# EAGLE design RscDroneBadgeMini (EAGLE 9.6.2)
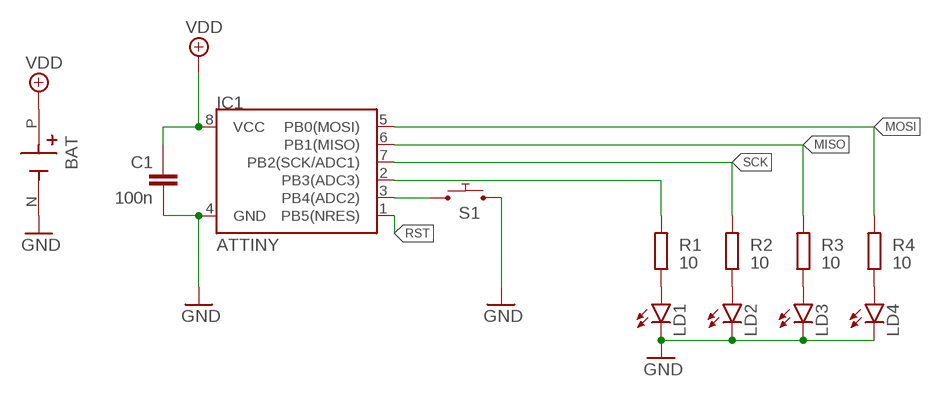
[diagram p0: schematic, sheet 1]

## Parts
BAT  CR2032  CR2032_PLASTIC  [CR2032_PLASTIC]
C1  100n  CAPACITOR_THT_2.54  [C_2.54]
IC1  ATTINY  ATTINY85-20PU  [DIL08]
LD1  LED_THT-5MM_NICE  [LED_5MM_NICE]
LD2  LED_THT-5MM_NICE  [LED_5MM_NICE]
LD3  LED_THT-5MM_NICE  [LED_5MM_NICE]
LD4  LED_THT-5MM_NICE  [LED_5MM_NICE]
R1  10  RESISTOR_0207_THT0204/7_ROUND  [RCL_0207]
R2  10  RESISTOR_0207_THT0204/7_ROUND  [RCL_0207]
R3  10  RESISTOR_0207_THT0204/7_ROUND  [RCL_0207]
R4  10  RESISTOR_0207_THT0204/7_ROUND  [RCL_0207]
S1  6x6mm BUTTON  PUSH_MOMENTARY_THT_6X6MM  [TACTILE-PTH]

## Nets
GND: BAT.N(NEG) C1.2 IC1.4(GND) LD1.K(C) LD2.K(C) LD3.K(C) LD4.K(C) S1.3 S1.4
MISO: IC1.6(PB1(MISO)) R3.2
MOSI: IC1.5(PB0(MOSI)) R4.2
N$1: IC1.3(PB4(ADC2)) S1.1 S1.2
N$3: LD1.A R1.1
N$5: LD2.A R2.1
N$6: LD3.A R3.1
N$7: LD4.A R4.1
N$9: IC1.2(PB3(ADC3)) R1.2
RST: IC1.1(PB5(NRES))
SCK: IC1.7(PB2(SCK/ADC1)) R2.2
VDD: BAT.P(POS) C1.1 IC1.8(VCC)

## Library data of the parts
BAT = BASTL_BATHOLDER:CR2032_PLASTIC: DS1092-04-B6P BH-25F-1
C1 = BASTL_CAPACITORS:CAPACITOR_THT: CAPACITOR, European symbol
IC1 = BASTL_ICS:ATTINY85: Atmel 8-pin 2/4/8kB flash uC; TYPE: THT
LD1-LD4 = BASTL_LEDS:LED_THT: [color]_[diameter]_[difused/clear] R_3mm_D
R1-R4 = BASTL_RESISTORS:RESISTOR_0207_THT: RESISTOR, European symbol
S1 = BASTL_SWITCHES:PUSH_MOMENTARY: Various NO switches- pushbuttons, reed, etc THT: TL1105SPF100Q SMT: TL3301SPF100QG, TL3301SPF160QG...; TYPE: THT

## Board
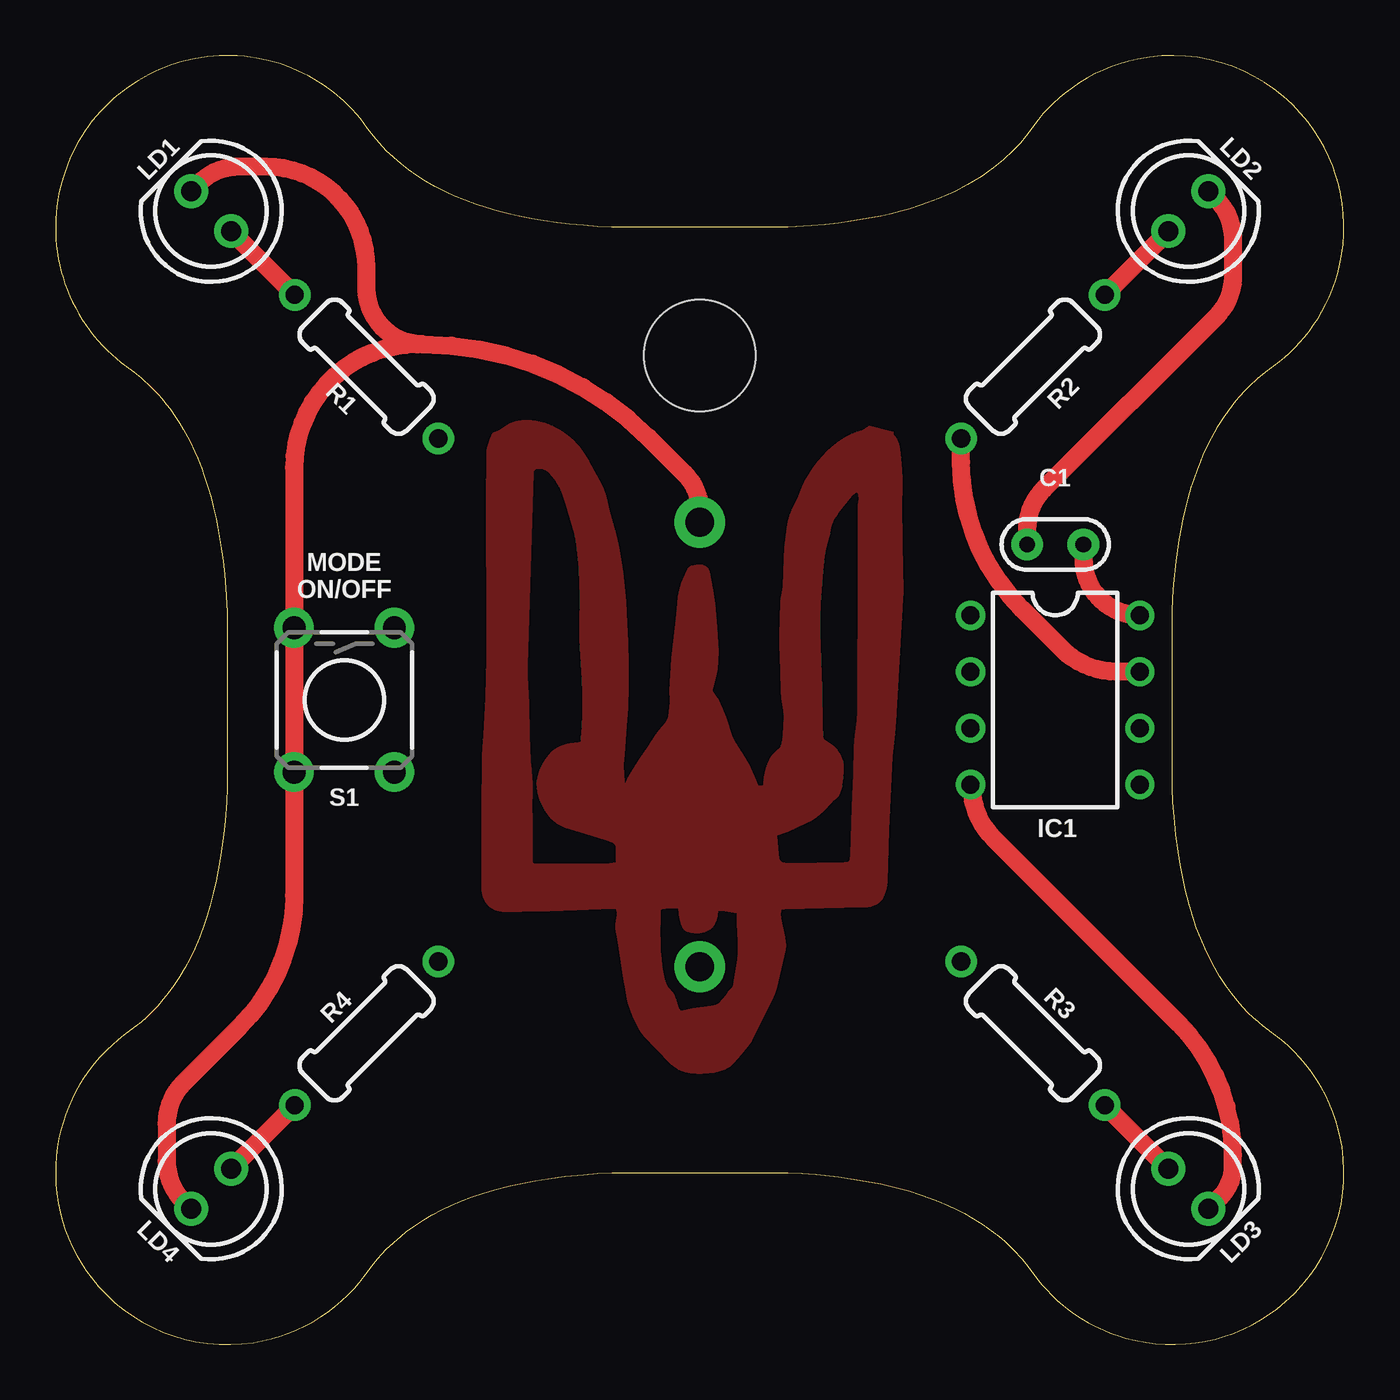
[diagram p1: board, top side]
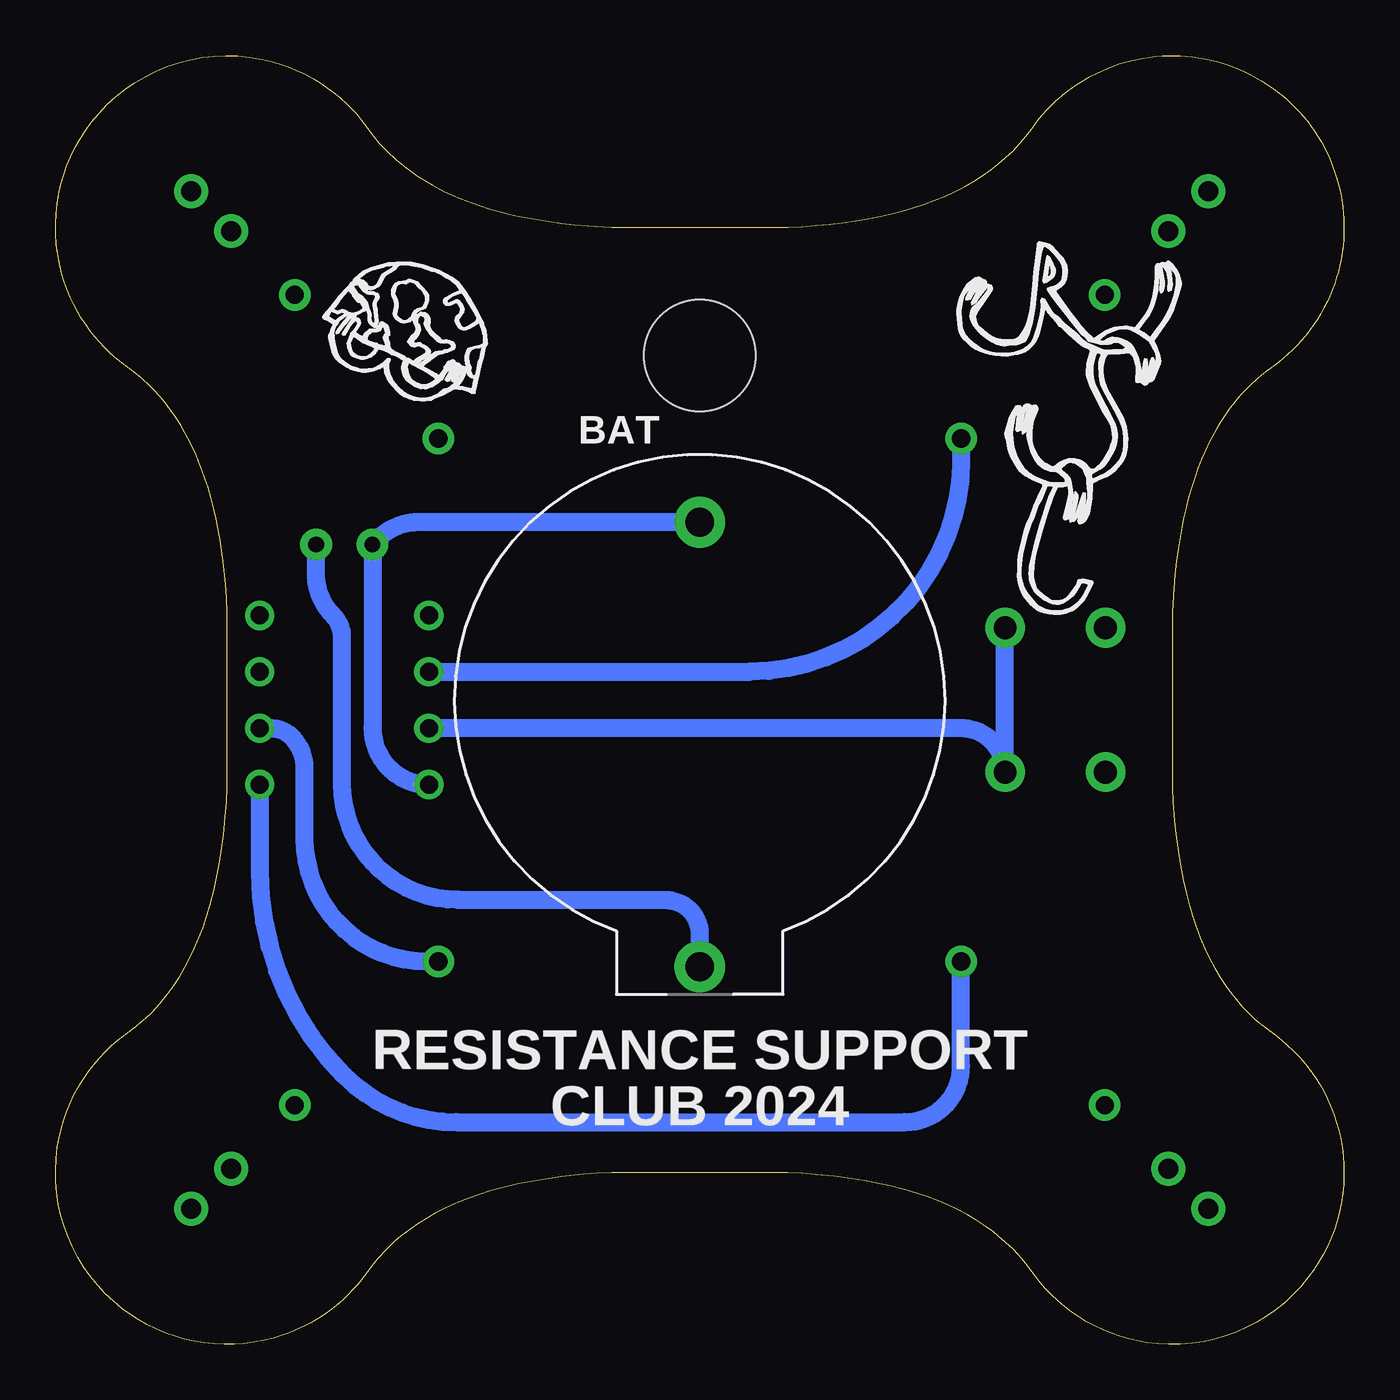
[diagram p2: board, bottom side, seen from below]

Size 58 x 58 mm. Coordinates in mm from the lower left corner, seen from the top.
Outline: 14.06,54.71 13.73,55.15 13.55,55.36 13.35,55.59 12.96,55.97 12.54,56.32 12.11,56.65 11.65,56.94 11.41,57.07 11.13,57.21 10.64,57.44 10.12,57.62 9.6,57.77 9.07,57.88 8.76,57.93 8.49,57.96 8.18,57.99 7.91,58 7.37,57.99 6.82,57.95 6.28,57.86 5.75,57.74 5.23,57.58 4.72,57.39 4.47,57.28 4.2,57.14 3.72,56.88 3.26,56.58 2.83,56.25 2.62,56.07 2.4,55.86 2.01,55.47 1.66,55.06 1.34,54.62 1.17,54.36 1.03,54.13 0.78,53.64 0.65,53.36 0.54,53.11 0.36,52.6 0.21,52.07 0.15,51.77 0.1,51.5 0.06,51.2 0.03,50.93 0.01,50.62 0,50.35 0,50.04 0.02,49.74 0.04,49.47 0.08,49.16 0.13,48.86 0.19,48.56 0.26,48.26 0.34,48 0.42,47.74 0.53,47.45 0.65,47.17 0.76,46.92 0.9,46.64 1.05,46.38 1.21,46.11 1.38,45.86 1.54,45.64 1.73,45.4 1.92,45.16 2.11,44.96 2.32,44.74 2.52,44.55 2.94,44.2 3.51,43.77 3.86,43.5 4.28,43.1 4.59,42.78 4.79,42.55 4.99,42.31 5.15,42.1 5.41,41.73 5.59,41.45 5.75,41.18 6.05,40.61 6.26,40.18 6.4,39.87 6.57,39.42 6.7,39.07 6.86,38.58 7,38.09 7.1,37.7 7.22,37.16 7.3,36.76 7.4,36.23 7.46,35.82 7.54,35.25 7.61,34.64 7.66,34.03 7.73,32.97 7.73,25.06 7.7,24.41 7.63,23.56 7.56,22.95 7.46,22.17 7.37,21.6 7.23,20.87 7.1,20.3 6.96,19.77 6.8,19.25 6.64,18.77 6.46,18.29 6.26,17.82 6.05,17.39 5.81,16.93 5.59,16.55 5.33,16.15 5.07,15.79 4.86,15.53 4.59,15.22 4.38,14.99 4.09,14.71 3.86,14.5 3.62,14.31 3.07,13.9 2.8,13.69 2.55,13.47 2.27,13.21 1.99,12.91 1.75,12.63 1.52,12.33 1.3,12.03 1.1,11.71 0.91,11.38 0.75,11.05 0.59,10.71 0.46,10.36 0.34,10 0.24,9.64 0.16,9.27 0.08,8.87 0.03,8.46 0.01,8.06 0,7.61 0.02,7.2 0.06,6.8 0.12,6.36 0.2,5.96 0.31,5.56 0.45,5.14 0.59,4.76 0.76,4.39 0.95,4.02 1.15,3.67 1.38,3.33 1.62,3 1.95,2.6 2.3,2.23 2.67,1.88 3.07,1.56 3.49,1.27 3.93,1 4.38,0.76 4.85,0.56 5.33,0.38 5.82,0.24 6.32,0.13 6.82,0.05 7.37,0.01 7.88,0 8.39,0.03 8.9,0.09 9.3,0.16 9.7,0.25 10.09,0.37 10.48,0.5 10.86,0.66 11.23,0.83 11.59,1.03 11.93,1.24 12.24,1.45 12.57,1.7 12.88,1.96 13.18,2.24 13.44,2.51 13.69,2.8 13.9,3.06 14.33,3.64 14.5,3.85 14.7,4.08 14.89,4.28 15.21,4.58 15.55,4.87 15.79,5.06 16.15,5.32 16.55,5.59 16.96,5.83 17.38,6.05 17.81,6.26 18.28,6.46 18.76,6.64 19.24,6.8 19.77,6.96 20.46,7.14 21.03,7.26 21.6,7.37 22.17,7.46 22.95,7.56 23.76,7.65 24.41,7.7 25.05,7.73 32.97,7.73 33.61,7.69 34.22,7.65 35.24,7.54 36.22,7.4 37.16,7.22 37.52,7.14 38.05,7.01 38.42,6.91 38.94,6.74 39.39,6.58 39.74,6.45 40.18,6.26 40.61,6.06 40.91,5.9 41.21,5.73 41.73,5.41 42.23,5.05 42.47,4.86 42.73,4.64 43.12,4.26 43.49,3.86 43.77,3.52 44.22,2.92 44.41,2.68 44.62,2.45 44.83,2.23 45.08,2 45.34,1.77 45.58,1.58 45.85,1.38 46.17,1.17 46.49,0.98 46.82,0.81 47.16,0.65 47.51,0.51 47.86,0.38 48.19,0.28 48.62,0.18 49.09,0.09 49.53,0.04 49.97,0.01 50.41,0 50.89,0.02 51.33,0.07 51.77,0.14 52.2,0.24 52.63,0.37 53.04,0.51 53.48,0.7 53.88,0.89 54.27,1.11 54.64,1.35 55,1.61 55.39,1.94 55.76,2.29 56.11,2.67 56.43,3.06 56.73,3.48 57,3.92 57.23,4.37 57.44,4.84 57.61,5.32 57.76,5.81 57.87,6.31 57.95,6.81 57.99,7.32 58,7.84 57.98,8.35 57.92,8.89 57.84,9.29 57.75,9.69 57.64,10.08 57.5,10.47 57.35,10.85 57.17,11.22 56.98,11.58 56.76,11.93 56.53,12.26 56.28,12.59 56.02,12.9 55.76,13.17 55.49,13.43 55.21,13.68 54.94,13.89 54.37,14.32 54.16,14.49 53.93,14.7 53.7,14.91 53.42,15.2 53.22,15.43 52.94,15.78 52.68,16.14 52.42,16.54 52.18,16.95 51.95,17.37 51.75,17.8 51.55,18.27 51.37,18.75 51.19,19.27 51.04,19.79 50.87,20.45 50.74,21.02 50.63,21.59 50.54,22.16 50.44,22.94 50.35,23.75 50.3,24.4 50.27,25.04 50.27,32.96 50.3,33.6 50.35,34.21 50.46,35.23 50.6,36.21 50.78,37.15 50.87,37.55 51,38.08 51.14,38.57 51.25,38.93 51.41,39.38 51.55,39.73 51.68,40.04 51.89,40.51 52.18,41.05 52.35,41.35 52.59,41.72 52.94,42.22 53.13,42.46 53.33,42.69 53.51,42.9 53.73,43.12 54.13,43.48 54.48,43.76 55.1,44.23 55.34,44.43 55.57,44.63 55.81,44.87 56.02,45.1 56.22,45.33 56.43,45.6 56.65,45.9 56.84,46.19 57.01,46.48 57.19,46.81 57.33,47.12 57.48,47.47 57.6,47.82 57.71,48.18 57.82,48.61 57.91,49.08 57.96,49.52 57.99,49.96 58,50.4 57.98,50.88 57.93,51.32 57.86,51.76 57.76,52.19 57.64,52.62 57.49,53.03 57.32,53.44 57.11,53.87 56.89,54.26 56.65,54.63 56.39,54.99 56.04,55.41 55.67,55.8 55.29,56.15 54.86,56.49 54.44,56.78 53.97,57.06 53.48,57.3 52.98,57.51 52.46,57.68 51.93,57.82 51.4,57.92 50.85,57.98 50.34,58 49.8,57.99 49.25,57.93 48.72,57.84 48.32,57.75 47.92,57.64 47.54,57.5 47.16,57.35 46.79,57.17 46.43,56.98 46.08,56.77 45.74,56.54 45.44,56.31 45.18,56.09 44.9,55.84 44.66,55.6 44.46,55.37 44.24,55.11 43.69,54.37 43.42,54.06 43.1,53.71 42.68,53.31 42.23,52.95 41.98,52.76 41.7,52.57 41.32,52.33 41.06,52.18 40.48,51.88 40.17,51.74 39.74,51.55 39.26,51.37 38.93,51.26 38.41,51.09 38.05,50.99 37.56,50.87 37.16,50.78 36.62,50.67 36.22,50.6 35.82,50.54 35.24,50.46 34.63,50.39 34.02,50.33 32.96,50.27 25.02,50.27 24.41,50.3 23.76,50.35 23.15,50.41 22.57,50.48 21.97,50.57 21.43,50.66 20.86,50.77 20.46,50.86 19.93,51 19.41,51.15 18.92,51.31 18.44,51.48 17.97,51.67 17.53,51.87 17.08,52.11 16.66,52.34 16.29,52.58 15.9,52.85 15.55,53.13 15.21,53.42 14.89,53.72 14.59,54.05 14.33,54.36 14.06,54.71
Copper layers (1*16): Top 0.035mm / dielectric 1.5mm / Bottom 0.035mm
Design rules "default_tenting_vias": minimum track width 6mil, minimum drill 0.35mm, track to track 6mil, track to pad 6mil, pad to pad 6mil, via to via 6mil, smd to smd 6mil, copper to edge 20mil, drill to drill 6mil, minimum pad ring 10mil, minimum via ring 8mil, stop-mask expansion 4mil, vias tented up to drill 15mil, thermal gap 10mil
Holes 5 mm at 29,44.5

### Footprints (pad centres in the part's own frame; a part is rotated, then mirrored left to right if it is on the bottom)
CR2032_PLASTIC = drill 1.3 pad 2.286: N -8,0; P 12,0
C_2.54 = drill 0.7 pad 1.422: 1 -1.27,0; 2 1.27,0
DIL08 = drill 0.813 pad 1.27: 1 -3.81,-3.81; 2 -1.27,-3.81; 3 1.27,-3.81; 4 3.81,-3.81; 5 3.81,3.81; 6 1.27,3.81; 7 -1.27,3.81; 8 -3.81,3.81
LED_5MM_NICE = drill 0.9 pad 1.524: A -1.27,0; K 1.27,0
RCL_0207 = drill 0.813 pad 1.422: 1 -4.572,0; 2 4.572,0
TACTILE-PTH = drill 1.016 pad 1.778: 1 -3.251,2.261; 2 3.251,2.261; 3 -3.251,-2.261; 4 3.251,-2.261

### Placement (x,y rotation side)
BAT  29,29 270 bottom
C1  45,36 180 top
IC1  45,29 270 top
LD1  7,51 135 top
LD2  51,51 45 top
LD3  51,7 315 top
LD4  7,7 225 top
R1  14,44 315 top
R2  44,44 225 top
R3  44,14 135 top
R4  14,14 45 top
S1  13,29 270 top

### Tracks (layer width: path | path; a pad name or v marks a point on that pad's centre or on a via)
GND
  Top 0.8: LD3.K 52.44,6.64 arc45 53,8 53,8.53 arc45 50.55,14.45 42.23,22.77 arc-45 41.25,25.13 IC1.4 | LD2.K 52.26,51.54 arc-45 53,49.74 53,48.05 arc-45 52.26,46.26 44.47,38.47 arc45 43.73,36.68 C1.2 | LD1.K 6.46,52.26 arc-45 8.26,53 9.46,53 arc-90 14,48.46 14,47.54 arc90 16.54,45 | LD4.K 5.74,6.46 arc-45 5,8.26 5,9.95 arc-45 5.74,11.74 8.29,14.29 arc45 10.74,20.21 S1.4 S1.3 10.74,39.46 arc-90 16.28,45 16.54,45 | BAT.N 29,37.53 arc45 28.32,39.18 26.7,40.8 arc45 16.57,45 16.54,45
  Bottom 0.8: IC1.4 arc90 43.73,27.73 C1.2 43.47,36.26 arc45 41.68,37 BAT.N
  pour Top (rank 3): 38.13,36.05 38.11,37.79 38.13,38.59 38.13,38.9 38.1,39.36 38.05,39.85 38,40.29 37.96,40.5 37.92,40.61 37.87,40.73 37.81,40.82 37.72,40.92 37.71,41.05 37.7,41.05 36.64,41.32 36.32,41.11 36.08,41.05 35.85,40.96 35.63,40.85 35.4,40.71 35.17,40.55 34.95,40.37 34.73,40.17 34.52,39.95 34.32,39.71 34.11,39.43 33.91,39.14 33.72,38.82 33.6,38.58 33.39,38.06 33.19,37.67 33.06,37.34 32.98,37.03 32.93,36.77 32.82,35.88 32.79,35.39 32.74,34.1 32.65,33.45 32.61,32.61 32.59,31.99 32.59,31.44 32.61,30.95 32.64,30.3 32.65,29.42 32.68,29.07 32.76,28.54 32.78,28.23 32.78,27.86 32.74,27.4 32.7,27.08 32.64,26.88 32.6,26.83 32.43,26.68 32.27,26.51 32.14,26.32 32.04,26.11 31.98,25.93 31.93,25.73 31.9,25.53 31.88,25.25 31.86,25.15 31.85,25.14 31.8,25.13 31.64,25.12 31.47,25.54 31.28,25.94 31.03,26.39 30.61,27.06 30.45,27.39 30.18,28.21 30.03,28.61 29.86,28.96 29.74,29.15 29.61,29.34 29.58,29.4 29.58,29.47 29.59,29.54 29.71,29.98 29.79,30.38 29.83,30.77 29.84,31.17 29.78,32.27 29.69,33.34 29.6,33.95 29.44,34.76 29.39,34.88 29.33,34.96 29.25,35.02 29.13,35.06 29.03,35.07 28.85,35.06 28.74,35.05 28.61,35.01 28.51,34.94 28.45,34.88 28.4,34.8 28.18,34.27 28.08,33.96 28.02,33.65 27.99,33.35 27.94,32.63 27.73,30.88 27.65,29.77 27.65,29.47 27.66,28.93 27.65,28.7 27.63,28.47 27.58,28.26 27.52,28.1 27.44,27.94 27.35,27.83 27.17,27.62 27.03,27.43 26.68,26.88 26.32,26.36 25.99,25.86 25.72,25.4 25.67,25.27 25.64,25.13 25.6,25.62 25.58,26.08 25.62,26.54 25.7,27.84 25.78,28.63 25.8,29.65 25.79,30.62 25.77,31.61 25.73,32.45 25.67,33.42 25.61,34.13 25.55,34.76 25.47,35.33 25.38,35.85 25.31,36.16 25.24,36.46 24.94,37.49 24.77,38.19 24.67,38.5 24.56,38.75 24.36,39.1 24,39.77 22.58,38.78 22.68,38.59 22.83,38.25 22.97,37.85 23.36,36.48 23.44,36.13 23.49,35.78 23.53,35.35 23.56,34.92 23.59,34.24 23.6,33.67 23.59,32.4 23.6,31.71 23.71,29.92 23.73,29.34 23.73,28.91 23.72,28.38 23.7,27.79 23.66,27.28 23.65,27.17 23.63,27.1 23.6,27.08 23.54,27.07 23.17,27.03 23.03,27 22.89,26.97 22.76,26.92 22.62,26.85 22.47,26.75 22.33,26.64 22.2,26.5 22.05,26.3 21.92,26.09 21.82,25.89 21.74,25.67 21.69,25.47 21.66,25.26 21.67,25.06 21.69,24.85 21.74,24.67 21.81,24.47 21.92,24.24 22.04,24.03 22.16,23.86 22.29,23.71 22.43,23.58 22.58,23.46 22.75,23.36 22.95,23.28 23.84,23.01 24.78,22.71 25.03,22.62 25.09,22.59 25.15,22.55 25.19,22.51 25.21,22.46 25.23,22.39 25.24,22.31 25.24,21.83 25.23,21.71 25.22,21.67 25.21,21.66 25.11,21.64 24.93,21.64 21.77,21.62 21.53,21.64 21.5,21.65 21.48,21.68 21.47,21.75 21.47,23.68 21.44,24.17 21.47,24.89 21.47,25.25 21.45,25.51 21.43,25.83 21.43,25.85 21.39,26.24 21.36,26.85 21.35,27.4 21.32,28.86 21.26,30.08 21.24,30.54 21.51,39.25 21.54,39.33 21.58,39.39 21.66,39.42 21.75,39.43 21.87,39.42 21.99,39.39 22.1,39.34 22.21,39.25 22.33,39.12 22.46,38.95 22.58,38.78 24,39.77 23.8,40.09 23.59,40.37 23.46,40.51 23.33,40.65 23.18,40.79 23.03,40.91 22.89,41.01 22.73,41.12 22.56,41.21 22.39,41.3 22.19,41.38 22.01,41.44 21.8,41.5 21.61,41.53 21.42,41.56 21.21,41.57 20.98,41.56 20.82,41.55 20.7,41.52 20.58,41.48 20.47,41.44 20.34,41.37 19.96,41.13 19.71,40.99 19.63,40.92 19.58,40.83 19.43,40.32 19.41,40.17 19.39,40.02 19.39,37.89 19.4,32.07 19.39,30.84 19.38,30.02 19.35,29.11 19.26,27.42 19.21,26.82 19.2,26.5 19.18,23.89 19.18,20.45 19.19,20.33 19.22,20.21 19.27,20.08 19.35,19.94 19.44,19.81 19.56,19.7 19.67,19.62 19.79,19.57 19.97,19.52 20.11,19.49 20.25,19.49 20.97,19.49 22.24,19.52 23.46,19.56 25.1,19.63 25.19,19.62 25.23,19.6 25.25,19.57 25.26,19.54 25.27,19.42 25.27,19.31 25.2,18.93 25.2,18.8 25.21,18.7 25.32,18.09 25.57,16.45 27.35,16.76 27.3,17.04 27.27,17.36 27.24,17.71 27.23,18.1 27.22,18.57 27.23,19.1 27.24,19.51 27.25,19.56 27.26,19.59 27.31,19.61 27.47,19.63 28.05,19.64 28.07,19.35 28.1,19.12 28.16,18.93 28.23,18.77 28.27,18.72 28.32,18.67 28.43,18.6 28.58,18.55 28.75,18.53 28.98,18.54 29.21,18.58 29.31,18.61 29.4,18.65 29.48,18.7 29.53,18.74 29.6,18.81 29.65,18.88 29.69,18.95 29.73,19.05 29.8,19.27 29.83,19.53 30.15,19.51 30.55,19.44 30.67,19.43 30.67,18.95 30.72,18.11 30.73,17.83 30.72,17.56 30.7,17.35 30.69,17.34 30.55,16.4 30.51,16.19 30.48,16.09 30.42,16 30.3,15.87 30.18,15.68 29.86,15.32 29.82,15.3 29.73,15.27 29.53,15.22 28.67,15.1 28.48,15.06 28.28,15.01 28.19,14.99 28.12,14.99 28.09,15.05 28.05,15.15 27.93,15.52 27.87,15.69 27.78,15.82 27.6,16.03 27.51,16.19 27.42,16.44 27.35,16.76 25.57,16.45 25.67,15.84 25.74,15.53 25.8,15.29 25.88,15.04 25.97,14.79 26.08,14.53 26.22,14.29 26.36,14.07 26.52,13.88 27.02,13.33 27.69,12.66 27.81,12.55 27.93,12.47 28.05,12.39 28.16,12.34 28.36,12.27 28.58,12.23 28.85,12.2 29.13,12.2 29.41,12.21 29.65,12.25 29.89,12.31 30.11,12.39 30.24,12.45 30.36,12.52 30.44,12.59 30.54,12.69 30.86,13.06 31.23,13.53 31.34,13.69 31.41,13.82 31.9,14.78 32.32,15.65 32.38,15.81 32.45,16.02 32.59,16.6 32.85,17.75 32.87,17.96 32.87,18.14 32.84,18.33 32.69,18.95 32.65,19.17 32.64,19.38 32.68,19.6 32.82,19.62 36.39,19.68 36.56,19.7 36.7,19.72 36.82,19.76 36.93,19.81 37.03,19.88 37.13,19.96 37.2,20.04 37.26,20.14 37.32,20.25 37.36,20.37 37.4,20.51 37.43,20.66 37.44,20.82 37.51,23.18 37.66,26.48 37.78,27.49 37.83,28.04 36.08,28.07 35.99,27.41 35.95,26.9 35.92,25.65 35.85,24.19 35.77,22.02 35.76,21.86 35.74,21.77 35.72,21.73 35.68,21.7 35.61,21.68 35.52,21.67 33.03,21.63 32.84,21.65 32.72,21.68 32.65,21.72 32.6,21.8 32.57,21.9 32.55,22.07 32.47,22.86 32.48,22.9 32.5,22.93 32.58,22.96 32.6,22.97 32.78,23.03 32.98,23.1 33.78,23.47 34.03,23.59 34.24,23.73 34.39,23.85 34.54,24 34.94,24.42 35,24.49 35.12,24.56 35.21,24.65 35.26,24.72 35.3,24.79 35.34,24.89 35.37,24.99 35.45,25.48 35.48,25.8 35.48,25.96 35.46,26.1 35.44,26.23 35.4,26.35 35.35,26.47 35.3,26.58 35.23,26.68 35.15,26.78 35.05,26.88 34.93,26.98 34.61,27.2 34.56,27.27 34.54,27.35 34.53,27.86 34.49,29.5 34.41,32.06 34.41,32.62 34.44,33.35 34.52,34.54 34.56,35.04 34.61,35.47 34.68,35.82 34.81,36.33 34.85,36.47 34.89,36.68 34.93,36.85 35,37.01 35.07,37.17 35.17,37.34 35.29,37.51 35.86,38.21 35.98,38.33 36.03,38.36 36.06,38.37 36.08,38.36 36.11,38.34 36.13,38.28 36.15,38.19 36.16,38.07 36.15,37.89 36.12,37.81 36.11,37.76 36.11,34.14 36.11,34.14 36.1,29.34 36.11,28.5 36.08,28.07 37.83,28.04 38.1,32.77 38.16,33.55 38.16,33.87 38.13,36.04
MISO
  Bottom 0.8: IC1.6 48.3,27.73 arc45 47.38,27.35 arc45 46.8,25.95 46.8,22.77 arc-90 41.26,17.23 R3.2
MOSI
  Bottom 0.8: IC1.5 48.81,21.28 arc-45 45.01,12.1 arc-45 39.95,10 19.77,10 arc-90 17.23,12.54 R4.2
N$1
  Bottom 0.8: S1.1 S1.2 arc-90 17.24,27.73 IC1.3
N$3
  Top 0.8: LD1.A R1.1
N$5
  Top 0.8: LD2.A R2.1
N$6
  Top 0.8: LD3.A R3.1
N$7
  Top 0.8: LD4.A R4.1
N$9
  Bottom 0.8: IC1.2 26.77,30.27 arc-90 17.23,39.81 R1.2
SCK
  Top 0.8: IC1.7 47.78,30.27 arc-45 45.3,31.3 43.5,33.1 arc-45 40.77,39.7 R2.2
VDD
  Top 0.8: C1.1 46.27,35.35 arc90 IC1.8
  Bottom 0.8: BAT.P 29,18.46 arc-90 30.54,20 39.86,20 arc90 45.1,25.24 45.1,31.83 arc-45 45.5,32.8 45.53,32.83 arc45 46.27,34.62 C1.1

### Text on the board
tPlace: MODE / ON/OFF
bPlace: RESISTANCE SUPPORT / CLUB 2024